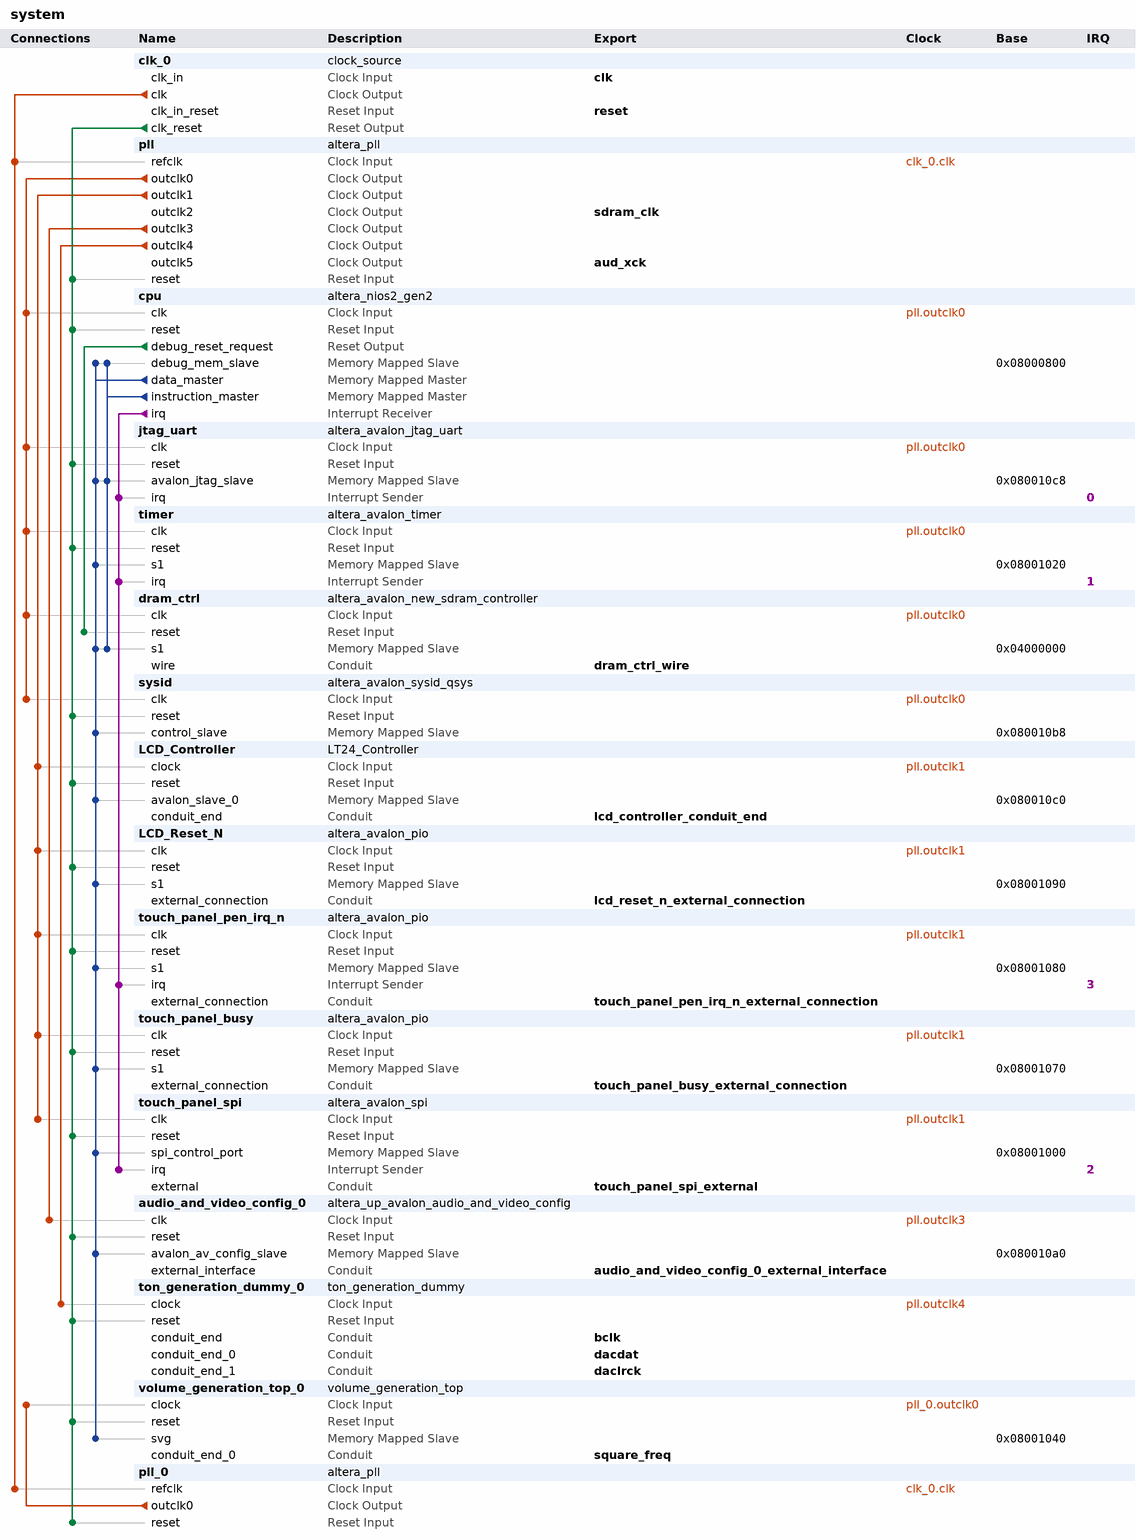
[diagram p0: system contents]
# Platform Designer (Qsys) system system, Cyclone V 5CSEMA5F31C6
# Parameters at their usual value, and those the tool derives, are not listed.
package require -exact qsys 17.1
create_system system
set_project_property DEVICE_FAMILY {Cyclone V}
set_project_property DEVICE 5CSEMA5F31C6

add_instance clk_0 clock_source 17.1
set_instance_parameter_value clk_0 clockFrequency 50000000

add_instance pll altera_pll 17.1
set_instance_parameter_value pll gui_device_speed_grade 1
set_instance_parameter_value pll gui_number_of_clocks 6
set_instance_parameter_value pll gui_operation_mode direct
set_instance_parameter_value pll gui_output_clock_frequency0 50.0
set_instance_parameter_value pll gui_output_clock_frequency1 15.0
set_instance_parameter_value pll gui_output_clock_frequency2 50.0
set_instance_parameter_value pll gui_output_clock_frequency3 12.0
set_instance_parameter_value pll gui_phase_shift2 -3333
set_instance_parameter_value pll gui_pll_mode {Integer-N PLL}
set_instance_parameter_value pll gui_reference_clock_frequency 50.0
set_instance_parameter_value pll gui_use_locked false

add_instance cpu altera_nios2_gen2 17.1
set_instance_parameter_value cpu dcache_size 2048
set_instance_parameter_value cpu exceptionSlave dram_ctrl.s1
set_instance_parameter_value cpu icache_size 4096
set_instance_parameter_value cpu impl Fast
set_instance_parameter_value cpu resetSlave dram_ctrl.s1

add_instance jtag_uart altera_avalon_jtag_uart 17.1
set_instance_parameter_value jtag_uart simInteractiveOptions NO_INTERACTIVE_WINDOWS

add_instance timer altera_avalon_timer 17.1
set_instance_parameter_value timer period 1
set_instance_parameter_value timer periodUnits MSEC

add_instance dram_ctrl altera_avalon_new_sdram_controller 17.1
set_instance_parameter_value dram_ctrl TAC 5.4
set_instance_parameter_value dram_ctrl TRCD 15.0
set_instance_parameter_value dram_ctrl TRP 15.0
set_instance_parameter_value dram_ctrl casLatency 3
set_instance_parameter_value dram_ctrl columnWidth 10
set_instance_parameter_value dram_ctrl dataWidth 16
set_instance_parameter_value dram_ctrl generateSimulationModel false
set_instance_parameter_value dram_ctrl model single_Micron_MT48LC4M32B2_7_chip
set_instance_parameter_value dram_ctrl numberOfBanks 4
set_instance_parameter_value dram_ctrl numberOfChipSelects 1
set_instance_parameter_value dram_ctrl powerUpDelay 100.0
set_instance_parameter_value dram_ctrl refreshPeriod 7.8125
set_instance_parameter_value dram_ctrl rowWidth 13

add_instance sysid altera_avalon_sysid_qsys 17.1
set_instance_parameter_value sysid id 1

add_instance LCD_Controller LT24_Controller 1.0

add_instance LCD_Reset_N altera_avalon_pio 17.1
set_instance_parameter_value LCD_Reset_N direction Output
set_instance_parameter_value LCD_Reset_N width 1

add_instance touch_panel_pen_irq_n altera_avalon_pio 17.1
set_instance_parameter_value touch_panel_pen_irq_n captureEdge true
set_instance_parameter_value touch_panel_pen_irq_n direction Input
set_instance_parameter_value touch_panel_pen_irq_n edgeType FALLING
set_instance_parameter_value touch_panel_pen_irq_n generateIRQ true
set_instance_parameter_value touch_panel_pen_irq_n irqType EDGE
set_instance_parameter_value touch_panel_pen_irq_n width 1

add_instance touch_panel_busy altera_avalon_pio 17.1
set_instance_parameter_value touch_panel_busy direction Input
set_instance_parameter_value touch_panel_busy width 1

add_instance touch_panel_spi altera_avalon_spi 17.1
set_instance_parameter_value touch_panel_spi clockPolarity 0
set_instance_parameter_value touch_panel_spi dataWidth 8
set_instance_parameter_value touch_panel_spi masterSPI true
set_instance_parameter_value touch_panel_spi numberOfSlaves 1
set_instance_parameter_value touch_panel_spi targetClockRate 32000

add_instance audio_and_video_config_0 altera_up_avalon_audio_and_video_config 17.1
set_instance_parameter_value audio_and_video_config_0 audio_in {Microphone to ADC}
set_instance_parameter_value audio_and_video_config_0 bit_length 24
set_instance_parameter_value audio_and_video_config_0 board DE10-Standard
set_instance_parameter_value audio_and_video_config_0 eai false
set_instance_parameter_value audio_and_video_config_0 line_in_bypass false
set_instance_parameter_value audio_and_video_config_0 sampling_rate {48 kHz}

add_instance ton_generation_dummy_0 ton_generation_dummy 1.0

add_instance volume_generation_top_0 volume_generation_top 1.0
set_instance_parameter_value volume_generation_top_0 cic1Bits 21
set_instance_parameter_value volume_generation_top_0 cic2Bits 25
set_instance_parameter_value volume_generation_top_0 cic3Bits 28
set_instance_parameter_value volume_generation_top_0 dat_len_avl 32

add_instance pll_0 altera_pll 17.1
set_instance_parameter_value pll_0 gui_device_speed_grade 1
set_instance_parameter_value pll_0 gui_number_of_clocks 1
set_instance_parameter_value pll_0 gui_operation_mode direct
set_instance_parameter_value pll_0 gui_output_clock_frequency0 54.0
set_instance_parameter_value pll_0 gui_pll_mode {Integer-N PLL}
set_instance_parameter_value pll_0 gui_reference_clock_frequency 50.0
set_instance_parameter_value pll_0 gui_use_locked false

# connections
add_connection clk_0.clk pll.refclk clock
add_connection clk_0.clk pll_0.refclk clock
add_connection pll.outclk0 cpu.clk clock
add_connection pll.outclk0 dram_ctrl.clk clock
add_connection pll.outclk0 jtag_uart.clk clock
add_connection pll.outclk0 sysid.clk clock
add_connection pll.outclk0 timer.clk clock
add_connection pll.outclk1 LCD_Controller.clock clock
add_connection pll.outclk1 LCD_Reset_N.clk clock
add_connection pll.outclk1 touch_panel_busy.clk clock
add_connection pll.outclk1 touch_panel_pen_irq_n.clk clock
add_connection pll.outclk1 touch_panel_spi.clk clock
add_connection pll.outclk3 audio_and_video_config_0.clk clock
add_connection pll.outclk4 ton_generation_dummy_0.clock clock
add_connection pll_0.outclk0 volume_generation_top_0.clock clock
add_connection clk_0.clk_reset audio_and_video_config_0.reset reset
add_connection clk_0.clk_reset cpu.reset reset
add_connection clk_0.clk_reset jtag_uart.reset reset
add_connection clk_0.clk_reset LCD_Controller.reset reset
add_connection clk_0.clk_reset LCD_Reset_N.reset reset
add_connection clk_0.clk_reset pll.reset reset
add_connection clk_0.clk_reset pll_0.reset reset
add_connection clk_0.clk_reset sysid.reset reset
add_connection clk_0.clk_reset timer.reset reset
add_connection clk_0.clk_reset ton_generation_dummy_0.reset reset
add_connection clk_0.clk_reset touch_panel_busy.reset reset
add_connection clk_0.clk_reset touch_panel_pen_irq_n.reset reset
add_connection clk_0.clk_reset touch_panel_spi.reset reset
add_connection clk_0.clk_reset volume_generation_top_0.reset reset
add_connection cpu.debug_reset_request dram_ctrl.reset reset
add_connection cpu.data_master audio_and_video_config_0.avalon_av_config_slave avalon
set_connection_parameter_value cpu.data_master/audio_and_video_config_0.avalon_av_config_slave baseAddress 0x080010a0
add_connection cpu.data_master cpu.debug_mem_slave avalon
set_connection_parameter_value cpu.data_master/cpu.debug_mem_slave baseAddress 0x08000800
add_connection cpu.data_master dram_ctrl.s1 avalon
set_connection_parameter_value cpu.data_master/dram_ctrl.s1 baseAddress 0x04000000
add_connection cpu.data_master jtag_uart.avalon_jtag_slave avalon
set_connection_parameter_value cpu.data_master/jtag_uart.avalon_jtag_slave baseAddress 0x080010c8
add_connection cpu.data_master LCD_Controller.avalon_slave_0 avalon
set_connection_parameter_value cpu.data_master/LCD_Controller.avalon_slave_0 baseAddress 0x080010c0
add_connection cpu.data_master LCD_Reset_N.s1 avalon
set_connection_parameter_value cpu.data_master/LCD_Reset_N.s1 baseAddress 0x08001090
add_connection cpu.data_master sysid.control_slave avalon
set_connection_parameter_value cpu.data_master/sysid.control_slave baseAddress 0x080010b8
add_connection cpu.data_master timer.s1 avalon
set_connection_parameter_value cpu.data_master/timer.s1 baseAddress 0x08001020
add_connection cpu.data_master touch_panel_busy.s1 avalon
set_connection_parameter_value cpu.data_master/touch_panel_busy.s1 baseAddress 0x08001070
add_connection cpu.data_master touch_panel_pen_irq_n.s1 avalon
set_connection_parameter_value cpu.data_master/touch_panel_pen_irq_n.s1 baseAddress 0x08001080
add_connection cpu.data_master touch_panel_spi.spi_control_port avalon
set_connection_parameter_value cpu.data_master/touch_panel_spi.spi_control_port baseAddress 0x08001000
add_connection cpu.data_master volume_generation_top_0.svg avalon
set_connection_parameter_value cpu.data_master/volume_generation_top_0.svg baseAddress 0x08001040
add_connection cpu.instruction_master cpu.debug_mem_slave avalon
set_connection_parameter_value cpu.instruction_master/cpu.debug_mem_slave baseAddress 0x08000800
add_connection cpu.instruction_master dram_ctrl.s1 avalon
set_connection_parameter_value cpu.instruction_master/dram_ctrl.s1 baseAddress 0x04000000
add_connection cpu.instruction_master jtag_uart.avalon_jtag_slave avalon
set_connection_parameter_value cpu.instruction_master/jtag_uart.avalon_jtag_slave baseAddress 0x080010c8
add_connection cpu.irq jtag_uart.irq interrupt
set_connection_parameter_value cpu.irq/jtag_uart.irq irqNumber 0
add_connection cpu.irq timer.irq interrupt
set_connection_parameter_value cpu.irq/timer.irq irqNumber 1
add_connection cpu.irq touch_panel_pen_irq_n.irq interrupt
set_connection_parameter_value cpu.irq/touch_panel_pen_irq_n.irq irqNumber 3
add_connection cpu.irq touch_panel_spi.irq interrupt
set_connection_parameter_value cpu.irq/touch_panel_spi.irq irqNumber 2

# exported interfaces
add_interface aud_xck clock source
set_interface_property aud_xck EXPORT_OF pll.outclk5
add_interface audio_and_video_config_0_external_interface conduit end
set_interface_property audio_and_video_config_0_external_interface EXPORT_OF audio_and_video_config_0.external_interface
add_interface bclk conduit end
set_interface_property bclk EXPORT_OF ton_generation_dummy_0.conduit_end
add_interface clk clock sink
set_interface_property clk EXPORT_OF clk_0.clk_in
add_interface dacdat conduit end
set_interface_property dacdat EXPORT_OF ton_generation_dummy_0.conduit_end_0
add_interface daclrck conduit end
set_interface_property daclrck EXPORT_OF ton_generation_dummy_0.conduit_end_1
add_interface dram_ctrl_wire conduit end
set_interface_property dram_ctrl_wire EXPORT_OF dram_ctrl.wire
add_interface lcd_controller_conduit_end conduit end
set_interface_property lcd_controller_conduit_end EXPORT_OF LCD_Controller.conduit_end
add_interface lcd_reset_n_external_connection conduit end
set_interface_property lcd_reset_n_external_connection EXPORT_OF LCD_Reset_N.external_connection
add_interface reset reset sink
set_interface_property reset EXPORT_OF clk_0.clk_in_reset
add_interface sdram_clk clock source
set_interface_property sdram_clk EXPORT_OF pll.outclk2
add_interface square_freq conduit end
set_interface_property square_freq EXPORT_OF volume_generation_top_0.conduit_end_0
add_interface touch_panel_busy_external_connection conduit end
set_interface_property touch_panel_busy_external_connection EXPORT_OF touch_panel_busy.external_connection
add_interface touch_panel_pen_irq_n_external_connection conduit end
set_interface_property touch_panel_pen_irq_n_external_connection EXPORT_OF touch_panel_pen_irq_n.external_connection
add_interface touch_panel_spi_external conduit end
set_interface_property touch_panel_spi_external EXPORT_OF touch_panel_spi.external

set_interconnect_requirement {$system} qsys_mm.clockCrossingAdapter HANDSHAKE
set_interconnect_requirement {$system} qsys_mm.enableEccProtection FALSE
set_interconnect_requirement {$system} qsys_mm.insertDefaultSlave FALSE
set_interconnect_requirement {$system} qsys_mm.maxAdditionalLatency 1

save_system system.qsys
